# Altium schematic sheet 022_GROVE-QWIIC-MikroBus-ADC.SchDoc
size 420 x 297 mm; Page Create Date: May 29, 2006; WebSite: https://www.seeedstudio.com; Variant Name: <Core Design>; Page Number: 22; Drawing: qxn; Schematic Name: BeaglePlay; Page Size: A3; Comment: Seeed Title; Page Count: 22; Page Name: 022_GROVE &QWIIC &MikroBus &ADC; Company: Seeed Studio; RevCode: v0.2; DsnPath: C:\Users\a0488739\Documents\GitHub\beagleplay\allegro\DVT\BEAGLEPLAYV020_220915.DSN; SchematicName: BeaglePlay; PageName: 022_GROVE &QWIIC &MikroBus &ADC; PageSize: A3; TopSchematic: True
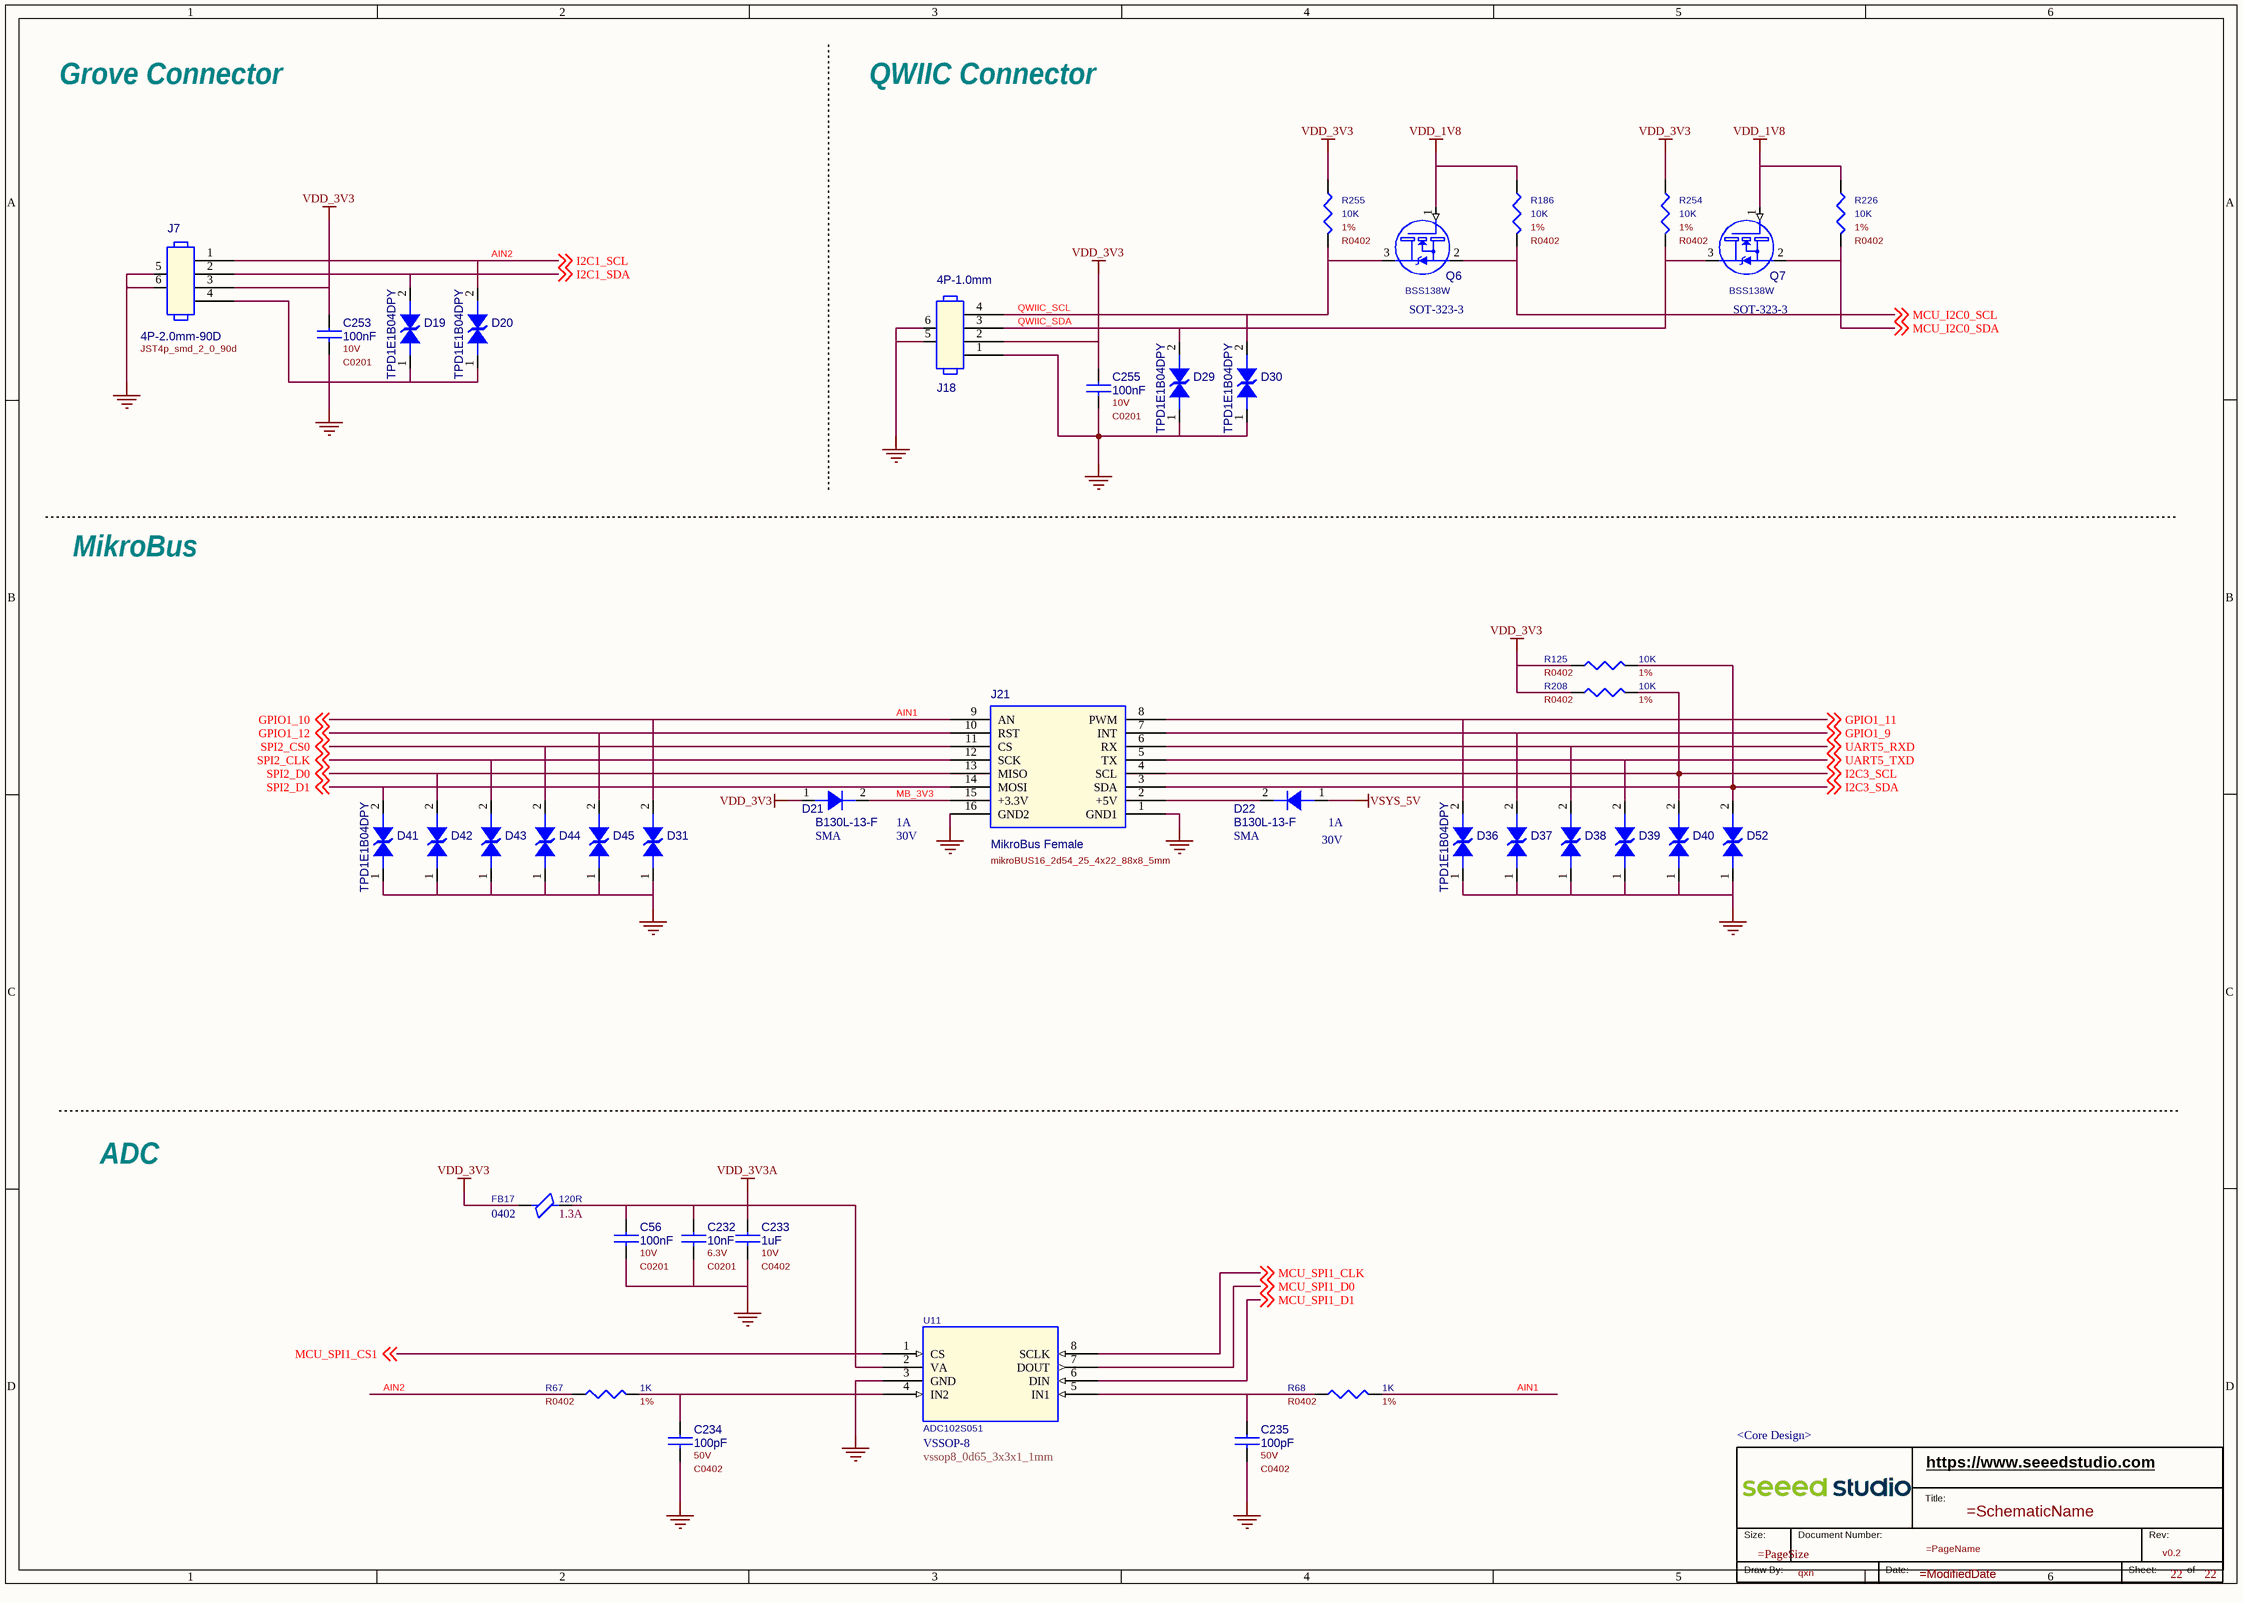
[diagram p0: 022_GROVE-QWIIC-MikroBus-ADC.SchDoc]

## Parts
*  RevCode: v0.2  Page Number: 22  Drawing: qxn  Variant Name: <Core Design>  (hidden comment: Seeed Title)  (graphical)
C56  value 100nF  Rating: 10V  [C0201]  (hidden comment: CC)
C232  value 10nF  Rating: 6.3V  [C0201]  (hidden comment: CC)
C233  value 1uF  Rating: 10V  [C0402]  (hidden comment: CC)
C234  value 100pF  Rating: 50V  [C0402]  (hidden comment: CC)
C235  value 100pF  Rating: 50V  [C0402]  (hidden comment: CC)
C253  value 100nF  Rating: 10V  [C0201]  (hidden comment: CC)
C255  value 100nF  Rating: 10V  [C0201]  (hidden comment: CC)
D19  value TPD1E1B04DPY  [D0402]  (hidden comment: DIODE TVS BI-DIR)
D20  value TPD1E1B04DPY  [D0402]  (hidden comment: DIODE TVS BI-DIR)
D21  value B130L-13-F  Package Size: SMA  Peak Forward Current: 1A  Repetitive Reverse Voltage Maximum: 30V  [DO_214AC_SMA]  (hidden comment: D)
D22  value B130L-13-F  Package Size: SMA  Peak Forward Current: 1A  Repetitive Reverse Voltage Maximum: 30V  [DO_214AC_SMA]  (hidden comment: D)
D29  value TPD1E1B04DPY  [D0402]  (hidden comment: DIODE TVS BI-DIR)
D30  value TPD1E1B04DPY  [D0402]  (hidden comment: DIODE TVS BI-DIR)
D31  DIODE TVS BI-DIR  [D0402]  (value not drawn)
D36  value TPD1E1B04DPY  [D0402]  (hidden comment: DIODE TVS BI-DIR)
D37  DIODE TVS BI-DIR  [D0402]  (value not drawn)
D38  DIODE TVS BI-DIR  [D0402]  (value not drawn)
D39  DIODE TVS BI-DIR  [D0402]  (value not drawn)
D40  DIODE TVS BI-DIR  [D0402]  (value not drawn)
D41  value TPD1E1B04DPY  [D0402]  (hidden comment: DIODE TVS BI-DIR)
D42  DIODE TVS BI-DIR  [D0402]  (value not drawn)
D43  DIODE TVS BI-DIR  [D0402]  (value not drawn)
D44  DIODE TVS BI-DIR  [D0402]  (value not drawn)
D45  DIODE TVS BI-DIR  [D0402]  (value not drawn)
D52  DIODE TVS BI-DIR  [D0402]  (value not drawn)
FB17  value 120R  Rating: 1.3A  Package Size: 0402  [L0402]  (hidden comment: FB)
J7  value 4P-2.0mm-90D  [JST4p_smd_2_0_90d]  (hidden comment: Header_4+2P)
J18  value 4P-1.0mm  [jst4p_1d0_6_5x4_35x3_1mm]  (hidden comment: Header_4+2P)
J21  value MikroBus Female  [mikroBUS16_2d54_25_4x22_88x8_5mm]  (hidden comment: Header MikroBus)
Q6  value BSS138W  [SOT-323-3]  (hidden comment: NMOS_123)
Q7  value BSS138W  [SOT-323-3]  (hidden comment: NMOS_123)
R67  value 1K  Rating: 1%  [R0402]  (hidden comment: R)
R68  value 1K  Rating: 1%  [R0402]  (hidden comment: R)
R125  value 10K  Rating: 1%  [R0402]  (hidden comment: R)
R186  value 10K  Rating: 1%  [R0402]  (hidden comment: R)
R208  value 10K  Rating: 1%  [R0402]  (hidden comment: R)
R226  value 10K  Rating: 1%  [R0402]  (hidden comment: R)
R254  value 10K  Rating: 1%  [R0402]  (hidden comment: R)
R255  value 10K  Rating: 1%  [R0402]  (hidden comment: R)
U11  Package Size: VSSOP-8  [vssop8_0d65_3x3x1_1mm]  (hidden comment: ADC102S051)

## Nets
GND: C56.2 C232.2 C233.2 C234.2 C235.2 C253.2 C255.2 D19.1 D20.1 D29.1 D30.1 D31.1 D36.1 D37.1 D38.1 D39.1 D40.1 D41.1 D42.1 D43.1 D44.1 D45.1 D52.1 J7.4 J7.5 J7.6 J18.1 J18.5 J18.6 J21.1(GND1) J21.16(GND2) U11.3(GND)
VDD_1V8: Q6.1(G) Q7.1(G) R186.1 R226.1
VDD_3V3: C253.1 C255.1 D21.1(A) FB17.1 J7.3 J18.2 R125.1 R208.1 R254.1 R255.1
VDD_3V3A: C56.1 C232.1 C233.1 FB17.2 U11.2(VA)
VSYS_5V: D22.1(A)
AIN1: D31.2 J21.9(AN) R68.2 ; off-sheet GPIO1_10  [also labelled GPIO1_10]
AIN2: D20.2 J7.1 R67.1 ; off-sheet I2C1_SCL  [also labelled I2C1_SCL]
GPIO1_9: D37.2 J21.7(INT) ; off-sheet GPIO1_9
GPIO1_11: D36.2 J21.8(PWM) ; off-sheet GPIO1_11
GPIO1_12: D45.2 J21.10(RST) ; off-sheet GPIO1_12
I2C1_SDA: D19.2 J7.2 ; off-sheet I2C1_SDA
I2C3_SCL: D40.2 J21.4(SCL) R208.2 ; off-sheet I2C3_SCL
I2C3_SDA: D52.2 J21.3(SDA) R125.2 ; off-sheet I2C3_SDA
MB_3V3: D21.2(C) J21.15(+3.3V)
MCU_I2C0_SCL: Q6.2(S) R186.2 ; off-sheet MCU_I2C0_SCL
MCU_I2C0_SDA: Q7.2(S) R226.2 ; off-sheet MCU_I2C0_SDA
MCU_SPI1_CLK: U11.8(SCLK) ; off-sheet MCU_SPI1_CLK
MCU_SPI1_CS1: U11.1(CS) ; off-sheet MCU_SPI1_CS1
MCU_SPI1_D0: U11.7(DOUT) ; off-sheet MCU_SPI1_D0
MCU_SPI1_D1: U11.6(DIN) ; off-sheet MCU_SPI1_D1
QWIIC_SCL: D30.2 J18.4 Q6.3(D) R255.2
QWIIC_SDA: D29.2 J18.3 Q7.3(D) R254.2
SPI2_CLK: D43.2 J21.12(SCK) ; off-sheet SPI2_CLK
SPI2_CS0: D44.2 J21.11(CS) ; off-sheet SPI2_CS0
SPI2_D0: D42.2 J21.13(MISO) ; off-sheet SPI2_D0
SPI2_D1: D41.2 J21.14(MOSI) ; off-sheet SPI2_D1
UART5_RXD: D38.2 J21.6(RX) ; off-sheet UART5_RXD
UART5_TXD: D39.2 J21.5(TX) ; off-sheet UART5_TXD
NetC234_1: C234.1 R67.2 U11.4(IN2)
NetC235_1: C235.1 R68.1 U11.5(IN1)
NetD22_2: D22.2(C) J21.2(+5V)

## Notes on the sheet
- Grove Connector
- QWIIC Connector
- MikroBus
- ADC
- (in symbol Seeed Title) https://www.seeedstudio.com; Title:; Size:; Document Number:; Rev:; Draw By:; Date:; Sheet:; of

## Library data of the parts
* = Seeed Title: Company: Seeed Studio; WebSite: https://www.seeedstudio.com; Schematic Name: =SchematicName; Page Size: =PageSize; Page Name: =PageName; Page Create Date: May 29, 2006; Page Count: 22; Page Modify Date: =ModifiedDate
C56 = CC: CAP, Ceramic, SMD, 100nF, 10%, 10V, 0201; Part Reference: C56; Manufacturer PN: CC0201KRX5R6BB104; Manufacturer: YAGEO; Company Part Status: ODYSSEY-i.MX8M; CLASS: DISCRETE; Temperature Coefficient: X5R; PN: 302010271; PCB Footprint: C0201; Tolerance: 10%; Dielectric Type: Ceramic; Package Size: 0201
C232 = CC: CAP, Ceramic, SMD, 10nF, 10%, 6.3V, 0201; Part Reference: C232; Manufacturer PN: CC0201KRX5R5BB103; Manufacturer: YAGEO; Company Part Status: ODYSSEY-i.MX8M; CLASS: DISCRETE; Temperature Coefficient: X5R; PN: 302011831; PCB Footprint: C0201; Tolerance: 10%; Dielectric Type: Ceramic; Package Size: 0201
C233 = CC: CAP, Ceramic, SMD, 1uF, 10%, 10V, 0402; Part Reference: C233; Manufacturer PN: CC0402KRX5R6BB105; Manufacturer: YAGEO; Company Part Status: BeagleBone Carrier Board; CLASS: DISCRETE; Temperature Coefficient: X5R; PN: 302010040; PCB Footprint: C0402; Tolerance: 10%; Dielectric Type: Ceramic; Package Size: 0402
C234 = CC: CAP, Ceramic, SMD, 100pF, 5%, 50V, 0402; Part Reference: C234; Company Part Status: Testo PoE; Manufacturer: YAGEO; Manufacturer PN: CC0402JRNPO9BN101; PN: 302010012; CLASS: DISCRETE; PCB Footprint: C0402; Package Size: 0402; Dielectric Type: Ceramic; Tolerance: 5%
C235 = CC: CAP, Ceramic, SMD, 100pF, 5%, 50V, 0402; Part Reference: C235; Company Part Status: Testo PoE; Manufacturer: YAGEO; Manufacturer PN: CC0402JRNPO9BN101; PN: 302010012; CLASS: DISCRETE; PCB Footprint: C0402; Package Size: 0402; Dielectric Type: Ceramic; Tolerance: 5%
C253 = CC: CAP, Ceramic, SMD, 100nF, 10%, 10V, 0201; Part Reference: C253; Company Part Status: ODYSSEY-i.MX8M; Manufacturer: YAGEO; Manufacturer PN: CC0201KRX5R6BB104; PN: 302010271; Temperature Coefficient: X5R; CLASS: DISCRETE; PCB Footprint: C0201; Package Size: 0201; Dielectric Type: Ceramic; Tolerance: 10%
C255 = CC: CAP, Ceramic, SMD, 100nF, 10%, 10V, 0201; Part Reference: C255; Company Part Status: ODYSSEY-i.MX8M; Manufacturer: YAGEO; Manufacturer PN: CC0201KRX5R6BB104; PN: 302010271; Temperature Coefficient: X5R; CLASS: DISCRETE; PCB Footprint: C0201; Package Size: 0201; Dielectric Type: Ceramic; Tolerance: 10%
D19 = DIODE TVS BI-DIR: DIO, ESD, TPD1E1B04DPY, --, 3.6V, --, X1SON(2); Part Reference: D19; Manufacturer PN: TPD1E1B04DPYR; Company Part Status: Grove Base Cape for PocketBeagle; Manufacturer: TI; Manufacturer Part Number: TPD1E1B04DPYR/T; CLASS: DISCRETE; PN: 304050798; PCB Footprint: D0402; Rated Voltage: 3.6V; Package Size: X1SON(2); Part Type: ESD; Status: Grove Base Cape for PocketBeagle; Temperature: -40¡ãC to 125¡ãC
D20 = DIODE TVS BI-DIR: DIO, ESD, TPD1E1B04DPY, --, 3.6V, --, X1SON(2); Part Reference: D20; Manufacturer PN: TPD1E1B04DPYR; Company Part Status: Grove Base Cape for PocketBeagle; Manufacturer: TI; Manufacturer Part Number: TPD1E1B04DPYR/T; CLASS: DISCRETE; PN: 304050798; PCB Footprint: D0402; Rated Voltage: 3.6V; Package Size: X1SON(2); Part Type: ESD; Status: Grove Base Cape for PocketBeagle; Temperature: -40¡ãC to 125¡ãC
D21 = D: DIO, Schottky, B130L-13-F, --, --, --, SMA; Part Reference: D21; Company Part Status: BeagleV-Ahead; Manufacturer: Diodes; PN: 304020024; CLASS: DISCRETE; PCB Footprint: DO_214AC_SMA; Manufacturer PN: B130L-13-F
D22 = D: DIO, Schottky, B130L-13-F, --, --, --, SMA; Part Reference: D22; Company Part Status: BeagleV-Ahead; Manufacturer: Diodes; PN: 304020024; CLASS: DISCRETE; PCB Footprint: DO_214AC_SMA; Manufacturer PN: B130L-13-F
D29 = DIODE TVS BI-DIR: DIO, ESD, TPD1E1B04DPY, --, 3.6V, --, X1SON(2); Part Reference: D29; Manufacturer: TI; Manufacturer Part Number: TPD1E1B04DPYR/T; Company Part Status: Grove Base Cape for PocketBeagle; Manufacturer PN: TPD1E1B04DPYR; PN: 304050798; CLASS: DISCRETE; PCB Footprint: D0402; Part Type: ESD; Status: Grove Base Cape for PocketBeagle; Temperature: -40¡ãC to 125¡ãC; Package Size: X1SON(2); Rated Voltage: 3.6V
D30 = DIODE TVS BI-DIR: DIO, ESD, TPD1E1B04DPY, --, 3.6V, --, X1SON(2); Part Reference: D30; Manufacturer: TI; Manufacturer Part Number: TPD1E1B04DPYR/T; Company Part Status: Grove Base Cape for PocketBeagle; Manufacturer PN: TPD1E1B04DPYR; PN: 304050798; CLASS: DISCRETE; PCB Footprint: D0402; Part Type: ESD; Status: Grove Base Cape for PocketBeagle; Temperature: -40¡ãC to 125¡ãC; Package Size: X1SON(2); Rated Voltage: 3.6V
D31 = DIODE TVS BI-DIR: DIO, ESD, TPD1E1B04DPY, --, 3.6V, --, X1SON(2); Part Reference: D31; Manufacturer PN: TPD1E1B04DPYR; Company Part Status: Grove Base Cape for PocketBeagle; Manufacturer: TI; Manufacturer Part Number: TPD1E1B04DPYR/T; CLASS: DISCRETE; PN: 304050798; PCB Footprint: D0402; Value: TPD1E1B04DPY; Rated Voltage: 3.6V; Package Size: X1SON(2); Part Type: ESD; Status: Grove Base Cape for PocketBeagle; Temperature: -40¡ãC to 125¡ãC
D36 = DIODE TVS BI-DIR: DIO, ESD, TPD1E1B04DPY, --, 3.6V, --, X1SON(2); Part Reference: D36; Manufacturer: TI; Manufacturer Part Number: TPD1E1B04DPYR/T; Company Part Status: Grove Base Cape for PocketBeagle; Manufacturer PN: TPD1E1B04DPYR; PN: 304050798; CLASS: DISCRETE; PCB Footprint: D0402; Part Type: ESD; Status: Grove Base Cape for PocketBeagle; Temperature: -40¡ãC to 125¡ãC; Package Size: X1SON(2); Rated Voltage: 3.6V
D37 = DIODE TVS BI-DIR: DIO, ESD, TPD1E1B04DPY, --, 3.6V, --, X1SON(2); Part Reference: D37; Manufacturer PN: TPD1E1B04DPYR; Company Part Status: Grove Base Cape for PocketBeagle; Manufacturer: TI; Manufacturer Part Number: TPD1E1B04DPYR/T; CLASS: DISCRETE; PN: 304050798; PCB Footprint: D0402; Value: TPD1E1B04DPY; Rated Voltage: 3.6V; Package Size: X1SON(2); Part Type: ESD; Status: Grove Base Cape for PocketBeagle; Temperature: -40¡ãC to 125¡ãC
D38 = DIODE TVS BI-DIR: DIO, ESD, TPD1E1B04DPY, --, 3.6V, --, X1SON(2); Part Reference: D38; Manufacturer PN: TPD1E1B04DPYR; Company Part Status: Grove Base Cape for PocketBeagle; Manufacturer: TI; Manufacturer Part Number: TPD1E1B04DPYR/T; CLASS: DISCRETE; PN: 304050798; PCB Footprint: D0402; Value: TPD1E1B04DPY; Rated Voltage: 3.6V; Package Size: X1SON(2); Part Type: ESD; Status: Grove Base Cape for PocketBeagle; Temperature: -40¡ãC to 125¡ãC
D39 = DIODE TVS BI-DIR: DIO, ESD, TPD1E1B04DPY, --, 3.6V, --, X1SON(2); Part Reference: D39; Manufacturer PN: TPD1E1B04DPYR; Company Part Status: Grove Base Cape for PocketBeagle; Manufacturer: TI; Manufacturer Part Number: TPD1E1B04DPYR/T; CLASS: DISCRETE; PN: 304050798; PCB Footprint: D0402; Value: TPD1E1B04DPY; Rated Voltage: 3.6V; Package Size: X1SON(2); Part Type: ESD; Status: Grove Base Cape for PocketBeagle; Temperature: -40¡ãC to 125¡ãC
D40 = DIODE TVS BI-DIR: DIO, ESD, TPD1E1B04DPY, --, 3.6V, --, X1SON(2); Part Reference: D40; Manufacturer PN: TPD1E1B04DPYR; Company Part Status: Grove Base Cape for PocketBeagle; Manufacturer: TI; Manufacturer Part Number: TPD1E1B04DPYR/T; CLASS: DISCRETE; PN: 304050798; PCB Footprint: D0402; Value: TPD1E1B04DPY; Rated Voltage: 3.6V; Package Size: X1SON(2); Part Type: ESD; Status: Grove Base Cape for PocketBeagle; Temperature: -40¡ãC to 125¡ãC
D41 = DIODE TVS BI-DIR: DIO, ESD, TPD1E1B04DPY, --, 3.6V, --, X1SON(2); Part Reference: D41; Manufacturer: TI; Manufacturer Part Number: TPD1E1B04DPYR/T; Company Part Status: Grove Base Cape for PocketBeagle; Manufacturer PN: TPD1E1B04DPYR; PN: 304050798; CLASS: DISCRETE; PCB Footprint: D0402; Part Type: ESD; Status: Grove Base Cape for PocketBeagle; Temperature: -40¡ãC to 125¡ãC; Package Size: X1SON(2); Rated Voltage: 3.6V
D42 = DIODE TVS BI-DIR: DIO, ESD, TPD1E1B04DPY, --, 3.6V, --, X1SON(2); Part Reference: D42; Manufacturer PN: TPD1E1B04DPYR; Company Part Status: Grove Base Cape for PocketBeagle; Manufacturer: TI; Manufacturer Part Number: TPD1E1B04DPYR/T; CLASS: DISCRETE; PN: 304050798; PCB Footprint: D0402; Value: TPD1E1B04DPY; Rated Voltage: 3.6V; Package Size: X1SON(2); Part Type: ESD; Status: Grove Base Cape for PocketBeagle; Temperature: -40¡ãC to 125¡ãC
D43 = DIODE TVS BI-DIR: DIO, ESD, TPD1E1B04DPY, --, 3.6V, --, X1SON(2); Part Reference: D43; Manufacturer Part Number: TPD1E1B04DPYR/T; Manufacturer: TI; Company Part Status: Grove Base Cape for PocketBeagle; Manufacturer PN: TPD1E1B04DPYR; PN: 304050798; CLASS: DISCRETE; PCB Footprint: D0402; Value: TPD1E1B04DPY; Temperature: -40¡ãC to 125¡ãC; Status: Grove Base Cape for PocketBeagle; Part Type: ESD; Package Size: X1SON(2); Rated Voltage: 3.6V
D44 = DIODE TVS BI-DIR: DIO, ESD, TPD1E1B04DPY, --, 3.6V, --, X1SON(2); Part Reference: D44; Manufacturer PN: TPD1E1B04DPYR; Company Part Status: Grove Base Cape for PocketBeagle; Manufacturer: TI; Manufacturer Part Number: TPD1E1B04DPYR/T; CLASS: DISCRETE; PN: 304050798; PCB Footprint: D0402; Value: TPD1E1B04DPY; Rated Voltage: 3.6V; Package Size: X1SON(2); Part Type: ESD; Status: Grove Base Cape for PocketBeagle; Temperature: -40¡ãC to 125¡ãC
D45 = DIODE TVS BI-DIR: DIO, ESD, TPD1E1B04DPY, --, 3.6V, --, X1SON(2); Part Reference: D45; Manufacturer PN: TPD1E1B04DPYR; Company Part Status: Grove Base Cape for PocketBeagle; Manufacturer: TI; Manufacturer Part Number: TPD1E1B04DPYR/T; CLASS: DISCRETE; PN: 304050798; PCB Footprint: D0402; Value: TPD1E1B04DPY; Rated Voltage: 3.6V; Package Size: X1SON(2); Part Type: ESD; Status: Grove Base Cape for PocketBeagle; Temperature: -40¡ãC to 125¡ãC
D52 = DIODE TVS BI-DIR: DIO, ESD, TPD1E1B04DPY, --, 3.6V, --, X1SON(2); Part Reference: D52; Manufacturer PN: TPD1E1B04DPYR; Company Part Status: Grove Base Cape for PocketBeagle; Manufacturer Part Number: TPD1E1B04DPYR/T; Manufacturer: TI; CLASS: DISCRETE; PN: 304050798; PCB Footprint: D0402; Value: TPD1E1B04DPY; Rated Voltage: 3.6V; Package Size: X1SON(2); Temperature: -40¡ãC to 125¡ãC; Status: Grove Base Cape for PocketBeagle; Part Type: ESD
FB17 = FB: Ferrite Bead, 120R, , 1.3A, 0402; Part Reference: FB17; Manufacturer PN: BLM15PD121SN1D; Manufacturer: Murata; Company Part Status: BeagleBone Carrier Board; CLASS: DISCRETE; PN: 303030040; PCB Footprint: L0402
J7 = Header_4+2P: CONN, Header, 4P, SMD; Part Reference: J7; Company Part Status: Eagleye 310s; Manufacturer: Cgeconn Electronics; Manufacturer PN: HY2.0-A 90D SMD; PN: 320110032; CLASS: IO; PCB Footprint: JST4p_smd_2_0_90d; Package Size: 4P-2.0-90D
J18 = Header_4+2P: CONN, JST connector, 4P-1.0mm, --, SMD; Part Reference: J18; Manufacturer PN: WY-4539; Manufacturer: SINOTOP Electronics; Company Part Status: BeaglePlay; CLASS: IO; PN: 320111319; PCB Footprint: jst4p_1d0_6_5x4_35x3_1mm
J21 = Header MikroBus: CONN, Header, Header 2x8 1.27mm, 2*8P, SMD; Part Reference: J21; Manufacturer PN: SOCKET mikroBUS 16 SMD; Manufacturer: MIKROE; Company Part Status: BeaglePlay; PN: 320991224; CLASS: IO; PCB Footprint: mikroBUS16_2d54_25_4x22_88x8_5mm; Package Size: 16.5x5x4.9mm
Q6 = NMOS_123: XSTR, MOSFET, N-Channel, BSS138W, 50V, 200mA, SOT-323-3, SMD; Part Reference: Q6; Manufacturer PN: BSS138W-7-F; Manufacturer: Diodes; Company Part Status: BeagleBone Carrier Board; CLASS: DISCRETE; PN: 305030000; PCB Footprint: SOT-323-3; Polarity: N-Channel; Package Size: SOT-323-3
Q7 = NMOS_123: XSTR, MOSFET, N-Channel, BSS138W, 50V, 200mA, SOT-323-3, SMD; Part Reference: Q7; Company Part Status: BeagleBone Carrier Board; Manufacturer: Diodes; Manufacturer PN: BSS138W-7-F; PN: 305030000; CLASS: DISCRETE; PCB Footprint: SOT-323-3; Package Size: SOT-323-3; Polarity: N-Channel
R67 = R: RES, Thick Film, 1K, 1%, 1/16W, SMD, 0402; Part Reference: R67; Company Part Status: Combox Pro; Manufacturer: YAGEO; Manufacturer PN: RC0402FR-071KL; PN: 301010044; CLASS: DISCRETE; PCB Footprint: R0402; Package Size: 0402; Rated Power: 1/16W
R68 = R: RES, Thick Film, 1K, 1%, 1/16W, SMD, 0402; Part Reference: R68; Company Part Status: Combox Pro; Manufacturer: YAGEO; Manufacturer PN: RC0402FR-071KL; PN: 301010044; CLASS: DISCRETE; PCB Footprint: R0402; Package Size: 0402; Rated Power: 1/16W
R125 = R: RES, Thick Film, 10K, 1%, 1/16W, SMD, 0402; Part Reference: R125; Manufacturer PN: RC0402FR-0710KL; Manufacturer: YAGEO; Company Part Status: BeagleBone Carrier Board; CLASS: DISCRETE; PN: 301010047; PCB Footprint: R0402; Rated Power: 1/16W; Package Size: 0402
R186 = R: RES, Thick Film, 10K, 1%, 1/16W, SMD, 0402; Part Reference: R186; Company Part Status: BeagleBone Carrier Board; Manufacturer: YAGEO; Manufacturer PN: RC0402FR-0710KL; PN: 301010047; CLASS: DISCRETE; PCB Footprint: R0402; Rated Power: 1/16W; Package Size: 0402
R208 = R: RES, Thick Film, 10K, 1%, 1/16W, SMD, 0402; Part Reference: R208; Company Part Status: BeagleBone Carrier Board; Manufacturer: YAGEO; Manufacturer PN: RC0402FR-0710KL; PN: 301010047; CLASS: DISCRETE; PCB Footprint: R0402; Rated Power: 1/16W; Package Size: 0402
R226 = R: RES, Thick Film, 10K, 1%, 1/16W, SMD, 0402; Part Reference: R226; Manufacturer PN: RC0402FR-0710KL; Manufacturer: YAGEO; Company Part Status: BeagleBone Carrier Board; CLASS: DISCRETE; PN: 301010047; PCB Footprint: R0402; Rated Power: 1/16W; Package Size: 0402
R254 = R: RES, Thick Film, 10K, 1%, 1/16W, SMD, 0402; Part Reference: R254; Manufacturer PN: RC0402FR-0710KL; Manufacturer: YAGEO; Company Part Status: BeagleBone Carrier Board; CLASS: DISCRETE; PN: 301010047; PCB Footprint: R0402; Rated Power: 1/16W; Package Size: 0402
R255 = R: RES, Thick Film, 10K, 1%, 1/16W, SMD, 0402; Part Reference: R255; Company Part Status: BeagleBone Carrier Board; Manufacturer: YAGEO; Manufacturer PN: RC0402FR-0710KL; PN: 301010047; CLASS: DISCRETE; PCB Footprint: R0402; Rated Power: 1/16W; Package Size: 0402
U11 = ADC102S051: IC, Converter, ADC, ADC102S051, VSSOP-8; Part Reference: U11; Manufacturer PN: ADC102S051CIMM/NOPB; Company Part Status: BeaglePlay; Manufacturer: TI; PN: 310100628; PCB Footprint: vssop8_0d65_3x3x1_1mm; Value: ADC102S051; CLASS: IC; Manufacturer Part Number: ADC102S051CIMM/NOPB